# Altium schematic sheet 模型USB.SchDoc
size A4
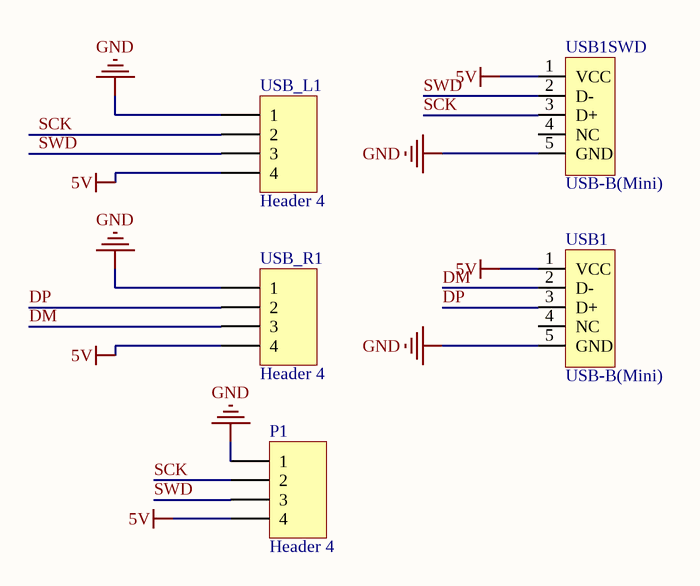
[diagram p0: 模型USB.SchDoc]

## Parts
P1  Header 4  [HDR1X4]
USB1  USB-B(Mini)  [USB/SM0.8-6H5_M]
USB1SWD  USB-B(Mini)  [USB/SM0.8-6H5_M]
USB_L1  Header 4  [SH1.0-4P]
USB_R1  Header 4  [SH1.0-4P]

## Nets
5V: P1.4 USB1.1(VCC) USB1SWD.1(VCC) USB_L1.4 USB_R1.4
GND: P1.1 USB1.5(GND) USB1SWD.5(GND) USB_L1.1 USB_R1.1
DM: USB1.2(D-) USB_R1.3
DP: USB1.3(D+) USB_R1.2
SCK: P1.2 USB1SWD.3(D+) USB_L1.2
SWD: P1.3 USB1SWD.2(D-) USB_L1.3

Not connected (* = marked no-connect by the designer): USB1 4(NC); USB1SWD 4(NC)

## Library data of the parts
P1 USB_L1 USB_R1 = Header 4: Header, 4-Pin; LatestRevisionDate: 17-Jul-2002; LatestRevisionNote: Re-released for DXP Platform.; Publisher: Altium Limited
USB1 USB1SWD = USB5